# EAGLE design Koester_station_adapter (EAGLE 7.7.0)
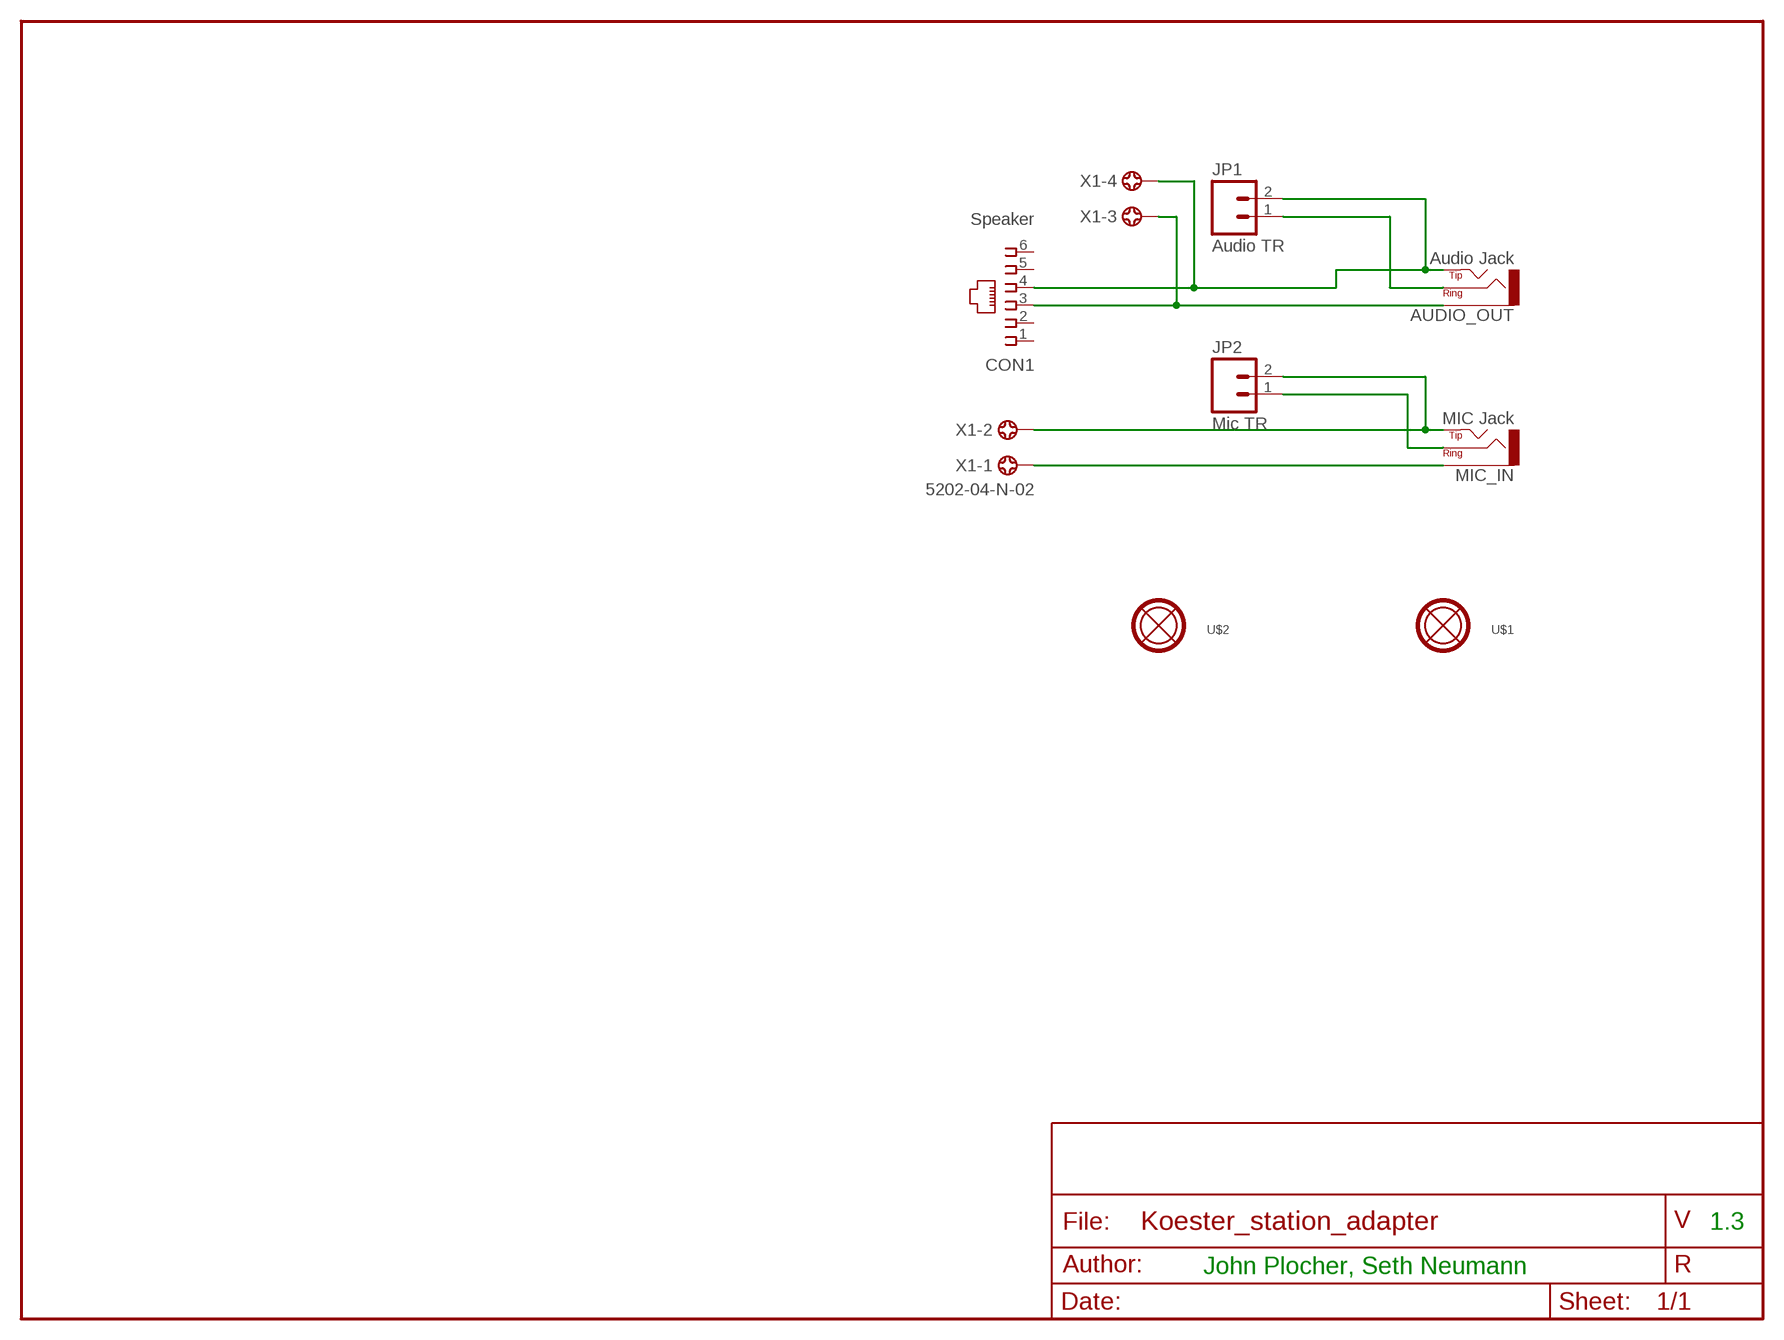
[diagram p0: schematic, sheet 1]

## Parts
AUDIO_OUT  Audio Jack  CONNECTOR-AUDIO3.5MM-ADAMTECH  [AUDIO-JACK-3.5MM_STEREO]
CON1  Speaker  CONNECTOR-RJ25-43860-2-MOLEX  [RJ25-INVERTED]
JP1  Audio TR  CONNECTOR-M02MOLEX-1X02-LOCK  [MOLEX-1X2_LOCK]
JP2  Mic TR  CONNECTOR-M02MOLEX-1X02-LOCK  [MOLEX-1X2_LOCK]
MIC_IN  MIC Jack  CONNECTOR-AUDIO3.5MM-ADAMTECH  [AUDIO-JACK-3.5MM_STEREO]
U$1  MOUNTINGHOLE  [MOUNTINGHOLE]
U$2  MOUNTINGHOLE  [MOUNTINGHOLE]
X1  5202-04-N-02  [5202-04-N-02]

## Nets
MIC_SLEEVE: MIC_IN.GND(SLEEVE) X1.1
MIC_TIP: JP2.2(B) MIC_IN.TIP X1.2
N$3: AUDIO_OUT.RING JP1.1(A)
N$6: JP2.1(A) MIC_IN.RING
OUT_SLEEVE: AUDIO_OUT.GND(SLEEVE) CON1.3 X1.3
OUT_TIP: AUDIO_OUT.TIP CON1.4 JP1.2(B) X1.4
Unconnected: CON1.1 CON1.2 CON1.5 CON1.6

## Notes on the sheet
- 1.3
- John Plocher, Seth Neumann

## Library data of the parts
AUDIO_OUT MIC_IN = SPCoast:CONNECTOR-AUDIO: 3.5mm Audio Jack PCB mount SKU: PRT-08032
CON1 = SPCoast:CONNECTOR-RJ25: AMP connector
JP1 JP2 = SPCoast:CONNECTOR-M02: PHOENIX CONNECTOR
U$1 U$2 = SPCoast:MOUNTINGHOLE: Mounting hole with top and bottom copper and stop rings
X1 = con-ebyelectro:5202-04-N-02: Barrier Blocks Sreies 5202 Source: http://www.ebyelectro.com/PDF/5202-XX-N-02.pdf; OC_FARNELL: unknown; OC_NEWARK: unknown

## Net classes
0 default: width 0.305 mm, drill 0.127 mm, clearance 0.254 mm
1 Power: width 0.61 mm, drill 0.127 mm, clearance 0.254 mm
2 Phone: width 0.305 mm, drill 0.127 mm, clearance 0.381 mm
3 Nasty Loads: width 0.61 mm, clearance 0.61 mm

## Board
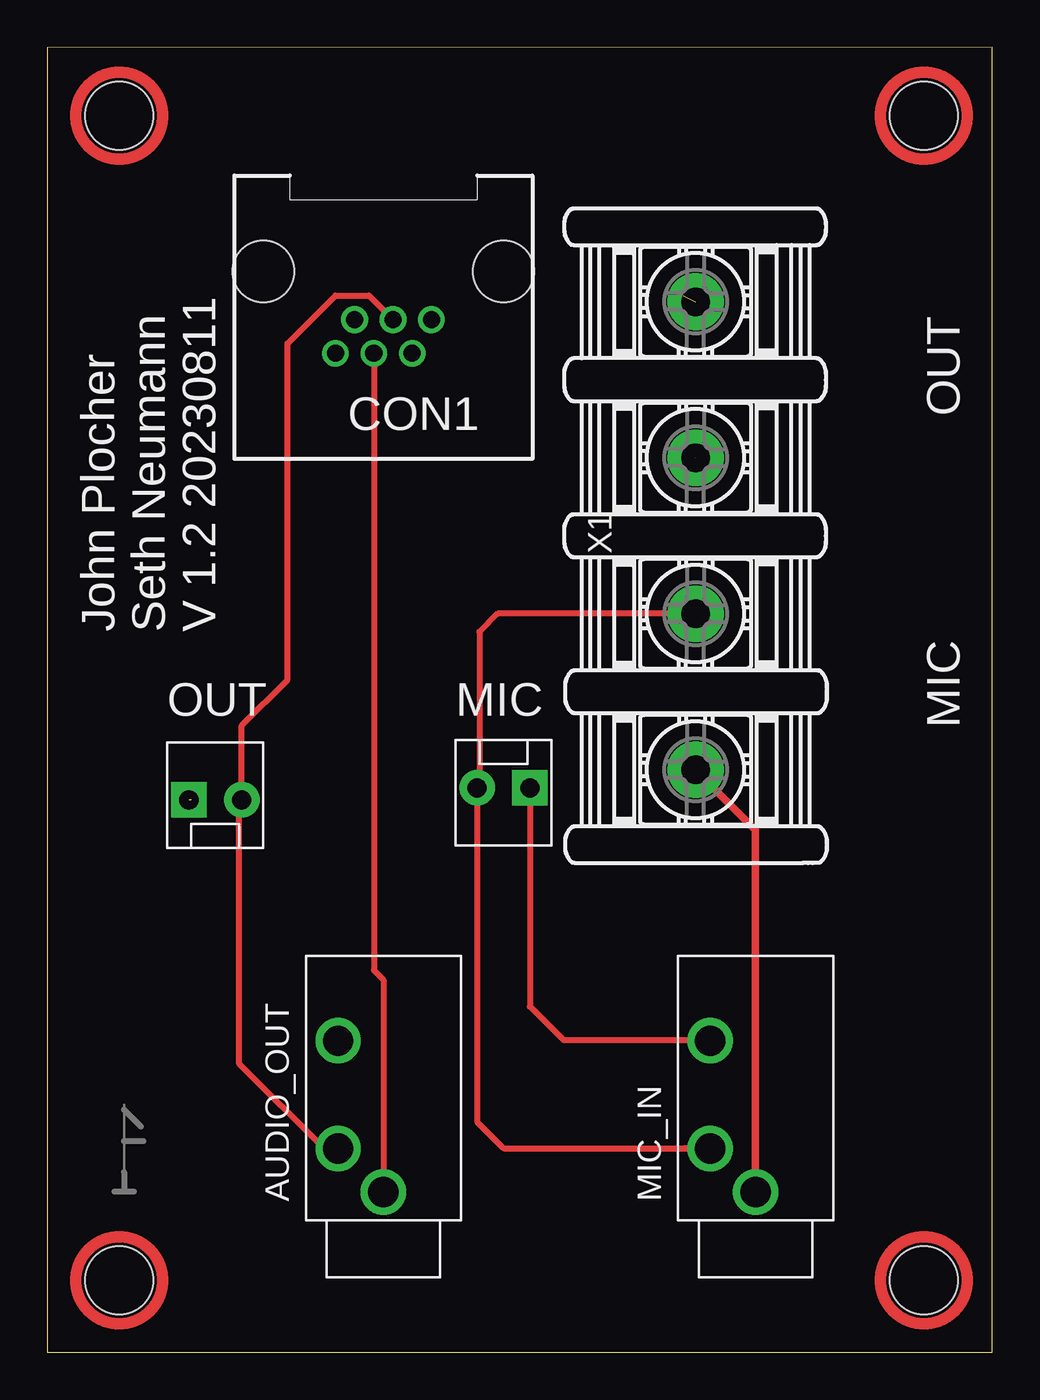
[diagram p1: board, top side]
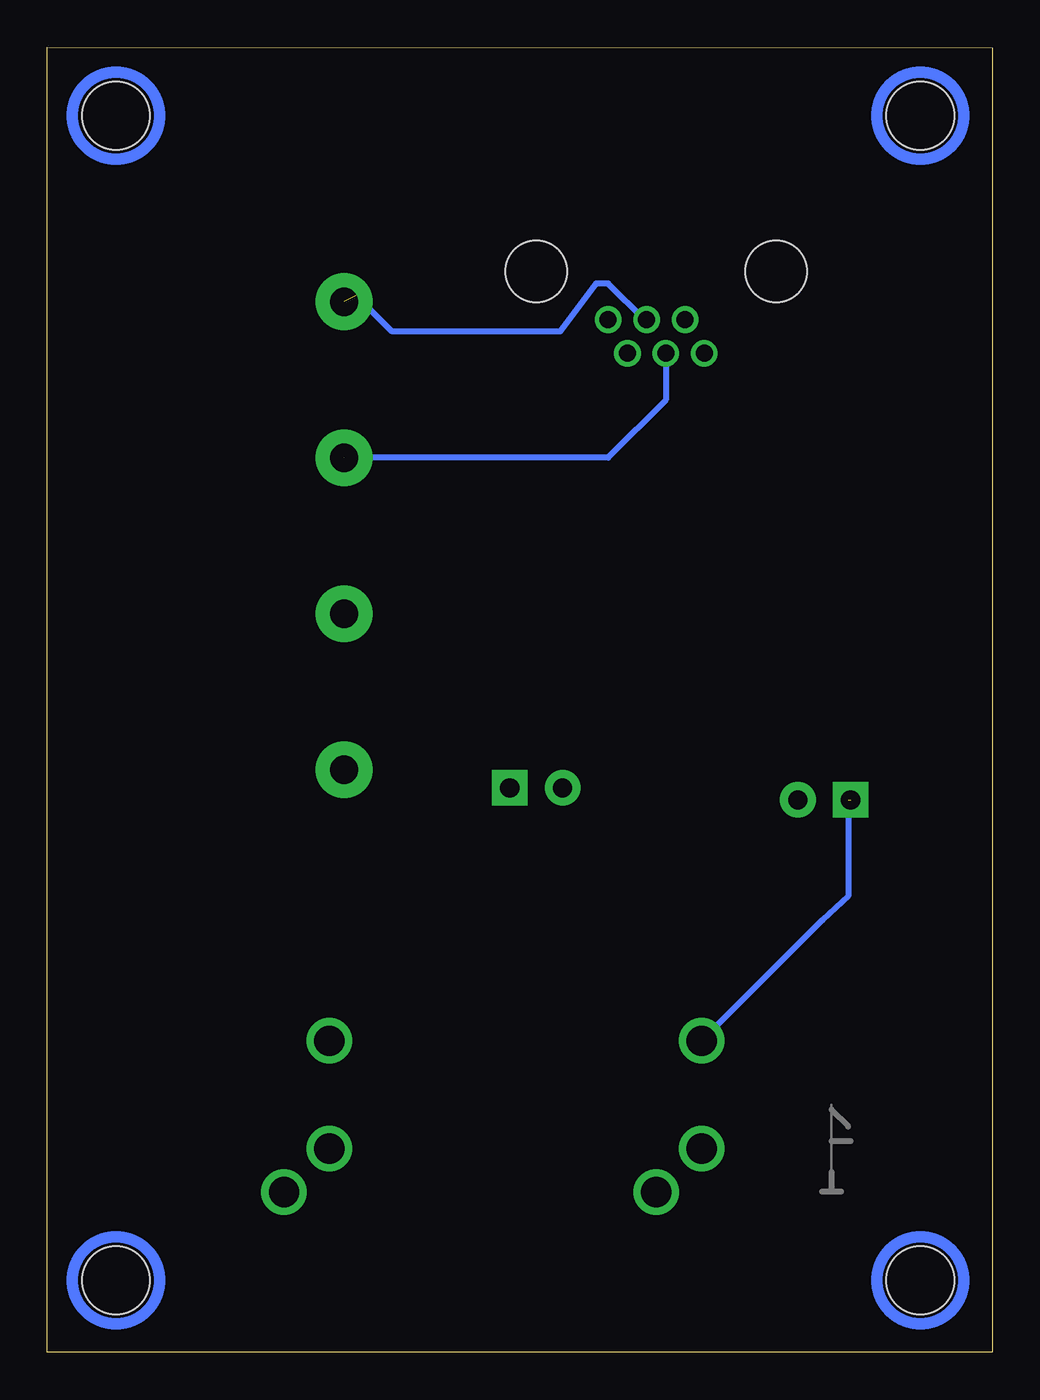
[diagram p2: board, bottom side, seen from below]

Size 49.99 x 69.01 mm. Coordinates in mm from the lower left corner, seen from the top.
Outline: 0,0 49.99,0 49.99,69.01 0,68.99 0,0
Copper layers (1*16): Top 0.035mm / dielectric 1.5mm / Bottom 0.035mm
Design rules "default": minimum track width 10mil, minimum drill 0.6mm, track to track 8mil, track to pad 8mil, pad to pad 8mil, via to via 8mil, smd to smd 8mil, copper to edge 40mil, drill to drill 8mil, minimum pad ring 10mil, minimum via ring 8mil, stop-mask expansion 4mil, vias tented up to drill 0mil, thermal gap 10mil

### Footprints (pad centres in the part's own frame; a part is rotated, then mirrored left to right if it is on the bottom)
AUDIO-JACK-3.5MM_STEREO = drill 1.6: GND -5.5,0; RING 2.5,2.4; TIP -3.2,2.4
RJ25-INVERTED = drill 0.9 pad 1.4: 1 2.54,4.318; 2 1.524,2.54; 3 0.508,4.318; 4 -0.508,2.54; 5 -1.524,4.318; 6 -2.54,2.54 | hole 3.251: -6.35,0; 6.35,0
MOLEX-1X2_LOCK = drill 1.016 pad 1.88 square: 1 -0.127,0 | drill 1.016 pad 1.88: 2 2.667,0
MOUNTINGHOLE = hole 3.6: 0,0
5202-04-N-02 = drill 1.5 pad 3: 1 -12.375,0; 2 -4.125,0; 3 4.125,0; 4 12.375,0

### Placement (x,y rotation side)
AUDIO_OUT  17.78,13.97 90 top
CON1  17.78,57.15 180 top
JP1  7.62,29.21 0 top
JP2  25.4,29.84 180 top
MIC_IN  37.47,13.97 90 top
U$1  46.35,3.81 0 top
U$2  3.81,65.41 0 top
U$3  MOUNTINGHOLE  [MOUNTINGHOLE]  3.81,3.81 0 top
U$4  MOUNTINGHOLE  [MOUNTINGHOLE]  46.35,65.41 0 top
U$5  [MRCSLOGOTOP]  2.79,8 0 top
U$6  [MRCSLOGOBTM]  2.16,8 0 top
U$7  [CA-PROP65WARNING]  21.34,45.97 0 top
X1  34.29,43.18 90 top

### Tracks (layer width: path | path; a pad name or v marks a point on that pad's centre or on a via)
MIC_SLEEVE
  Top 0.406: MIC_IN.GND 37.47,27.63 X1.1
MIC_TIP
  Top 0.305: 33.68,10.77 MIC_IN.TIP 35.67,10.79 24.13,10.79 22.73,12.19 JP2.2 22.86,29.97 22.86,38.1 23.82,39.05 X1.2
N$3  (1 unrouted)
  Bottom 0.305: 7.62,29.21 7.62,24.13 8.99,22.86 AUDIO_OUT.RING
N$6
  Top 0.305: JP2.1 25.53,18.29 27.3,16.51 35.66,16.51 MIC_IN.RING
OUT_SLEEVE  (1 unrouted)
  Top 0.305: CON1.3 17.27,20.19 17.78,19.68 AUDIO_OUT.GND
  Bottom 0.305: CON1.3 17.27,50.35 20.32,47.31 X1.3
OUT_TIP  (1 unrouted)
  Top 0.305: AUDIO_OUT.TIP 14.63,10.77 10.16,15.24 10.16,29.08 JP1.2 10.29,33.15 12.7,35.56 12.7,53.34 15.24,55.88 17.02,55.88 CON1.4
  Bottom 0.305: CON1.4 18.41,54.61 20.32,56.52 20.95,56.52 22.86,53.98 31.75,53.98 33.66,55.88

### Text on the board
tPlace: OUT | John Plocher / Seth Neumann / V 1.2 20230811 | OUT | MIC | MIC
tDocu: Mic/Spkr adapter
_tNames: CON1 | CON1 | AUDIO_OUT | AUDIO_OUT | MIC_IN | MIC_IN